# Altium schematic sheet PA.SchDoc
size B; Organization: MASA; SheetNumber: 3; SheetTotal: 6
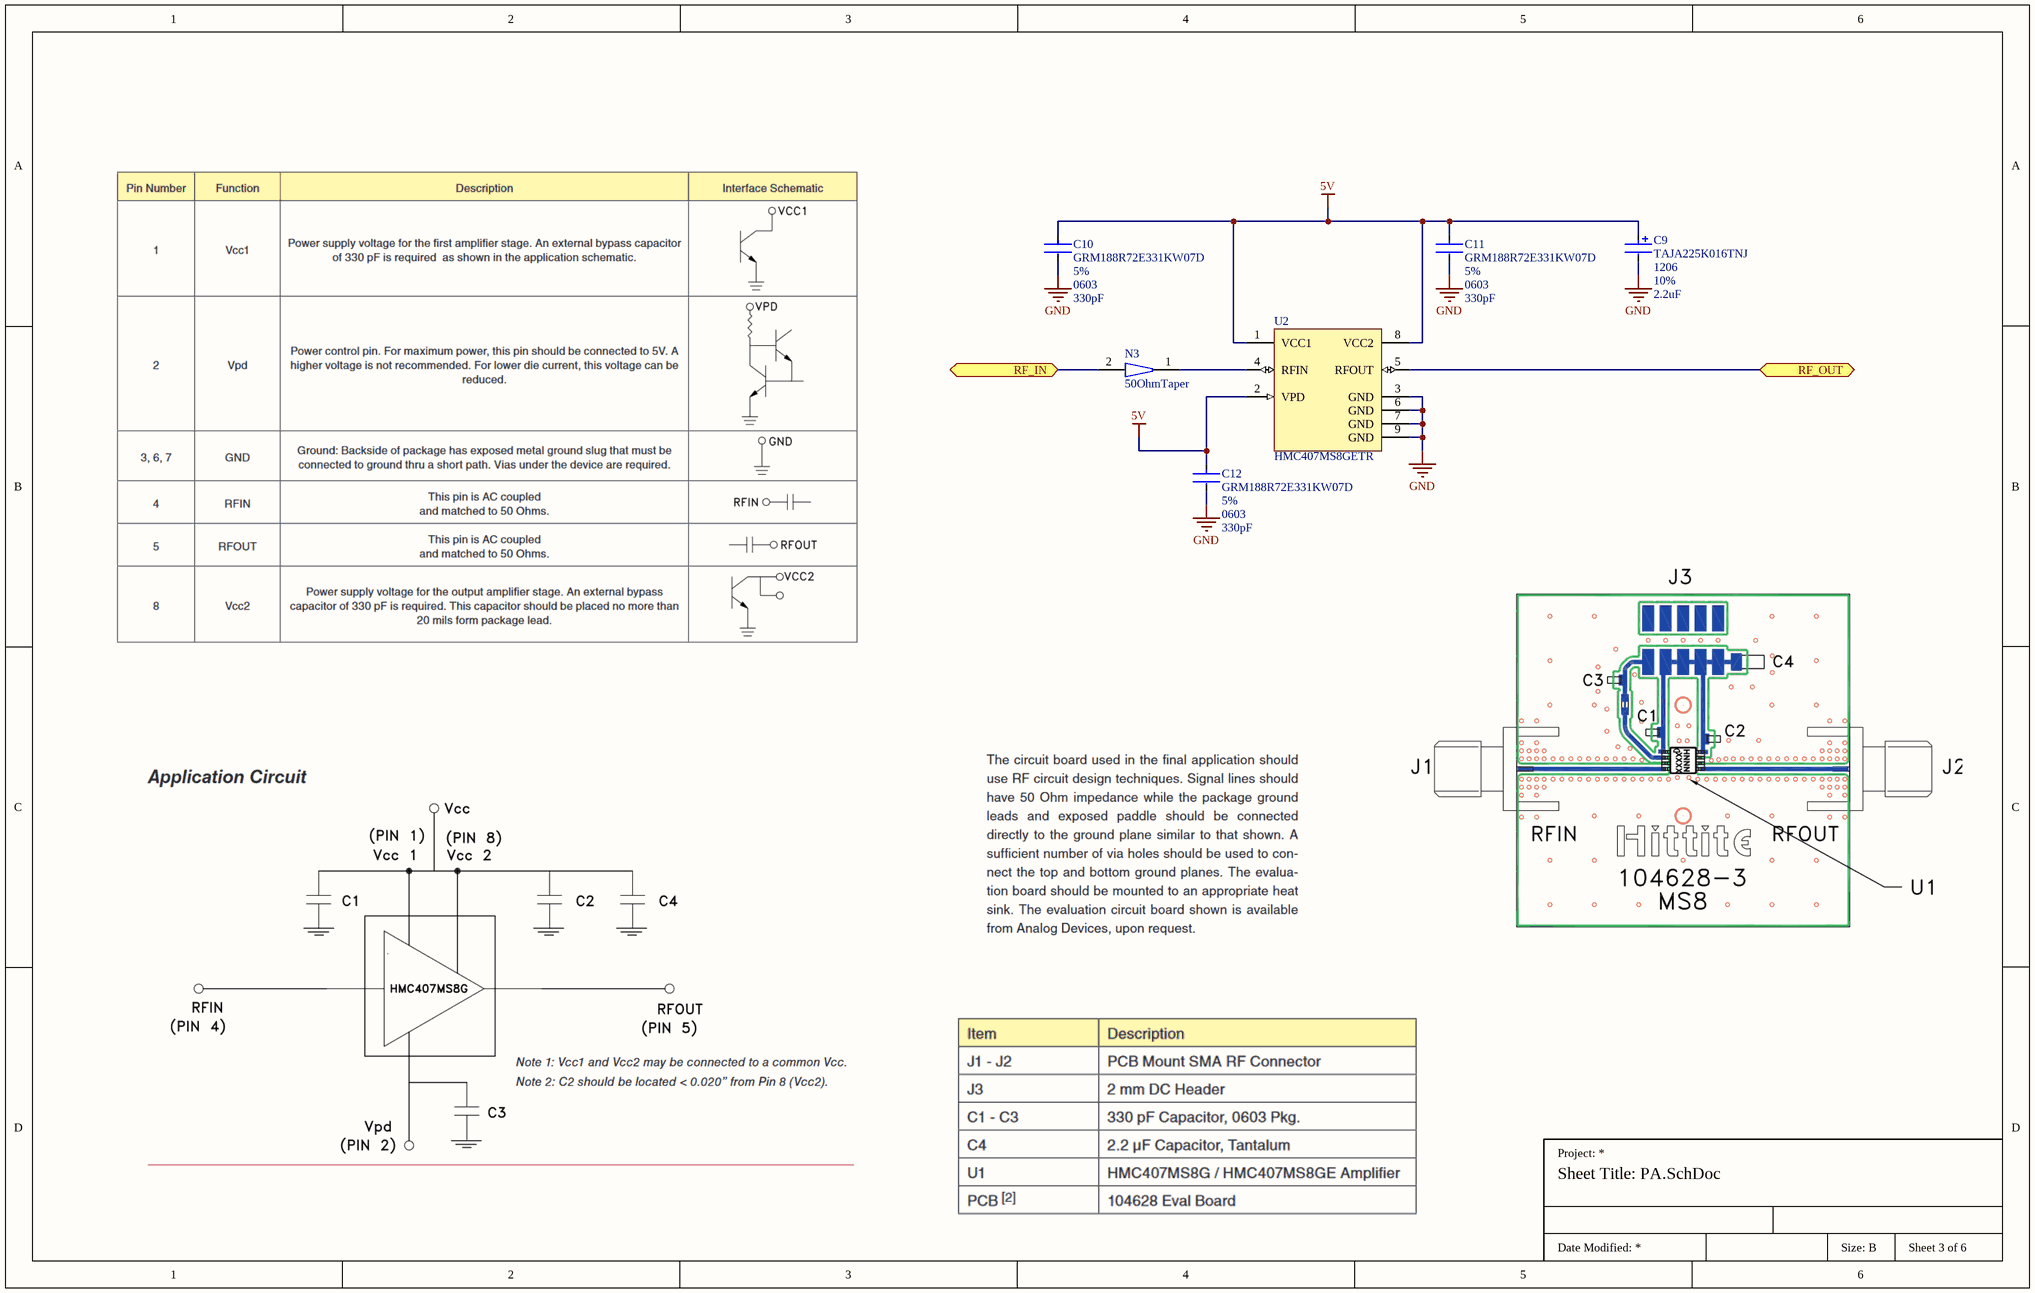
[diagram p0: PA.SchDoc]

## Parts
C9  TAJA225K016TNJ  value 2.2uF  Package: 1206  Tolerance: 10%  [TantCapKyocera1206]
C10  GRM188R72E331KW07D  value 330pF  Tolerance: 5%  Package: 0603  [Murata0603CeramicCap]
C11  GRM188R72E331KW07D  value 330pF  Tolerance: 5%  Package: 0603  [Murata0603CeramicCap]
C12  GRM188R72E331KW07D  value 330pF  Tolerance: 5%  Package: 0603  [Murata0603CeramicCap]
N3  50OhmTaper  [50OhmTaper]  (net tie, no BOM)
U2  HMC407MS8GETR  [HMC407MS8GETR]

## Ports
RF_IN (bidir), RF_OUT (bidir)

## Nets
5V: C9.1 C10.1 C11.1 C12.1 U2.1(VCC1) U2.2(VPD) U2.8(VCC2)
GND: C9.2 C10.2 C11.2 C12.2 U2.3(GND) U2.6(GND) U2.7(GND) U2.9(GND)
RF_IN: N3.2 ; port RF_IN
RF_OUT: U2.5(RFOUT) ; port RF_OUT
NetN3_1: N3.1 U2.4(RFIN)

## Notes on the sheet
- Size: B

## Library data of the parts
C9 = TAJA225K016TNJ: 2.2 µF Molded Tantalum Capacitors 16 V 1206 (3216 Metric) 6.5Ohm @ 100kHz; Manufacturer: Kyocera AVX; Manufacturer Part Number: TPSB226K020T0400; Supplier: Future Electronics; Supplier Part Number: 9110023; RoHS: Yes; Category: Tantalum Capacitors; Stock: 2000; Pricing: 2000=0.3, 4000=0.29, 6000=0.29, 8000=0.285, 10000=0.28 (USD); Pins: 2; Dielectric Material: Tantalum; Capacitor Type: Tantalum; Reach SVHC Compliant: Yes; RoHS Compliant: Yes; ComponentLink1URL: https://datasheet.ciiva.com:443/pdfs/VipMasterIC/IC/AVXC/AVXC-S-A0008672189/AVXC-S-A0008672189-1.pdf?src-supplier=IHS+Markit; ComponentLink1Description: https://datasheet.ciiva.com:443/pdfs/VipMasterIC/IC/AVXC/AVXC-S-A0008672189/AVXC-S-A0008672189-1.pdf?src-supplier=IHS+Markit; Supplier 1: Newark; Supplier Part Number 1: 67AK1283
C10-C12 = GRM188R72E331KW07D: 330 pF ±10% 250V Ceramic Capacitor X7R 0603 (1608 Metric); Automotive Grade: Grade 1; RoHS: TRUE; Material: Ceramic; Temperature Range High: +125°C; Lead Free: Yes; Category: Cap; ComponentLink2Description: Datasheet; Temperature Range Low: -55°C; Device Class L1: Passive Components; Voltage Rating: 250 V; Automotive: Yes; Device Class L3: Ceramic Capacitors; ComponentLink2URL: https://api.kemet.com/component-edge/download/datasheet/C0603C100J5GACAUTO.pdf; Device Class L2: Capacitors; Temperature Characteristic: X7R; Supplier 1: Avnet; Supplier Part Number 1: GRM1555C1H101JA01D
N3 = 50OhmTaper: Triangular taper from 50 Ohms to 0402 width
U2 = HMC407MS8GETR: RF Amplifier IC General Purpose 5GHz ~ 7GHz 8-MSOP-EP; Supplier 1: Mouser; Supplier Part Number 1: 584-HMC407MS8GETR